# EAGLE schematic PMS_sensor (EAGLE 9.6.2)
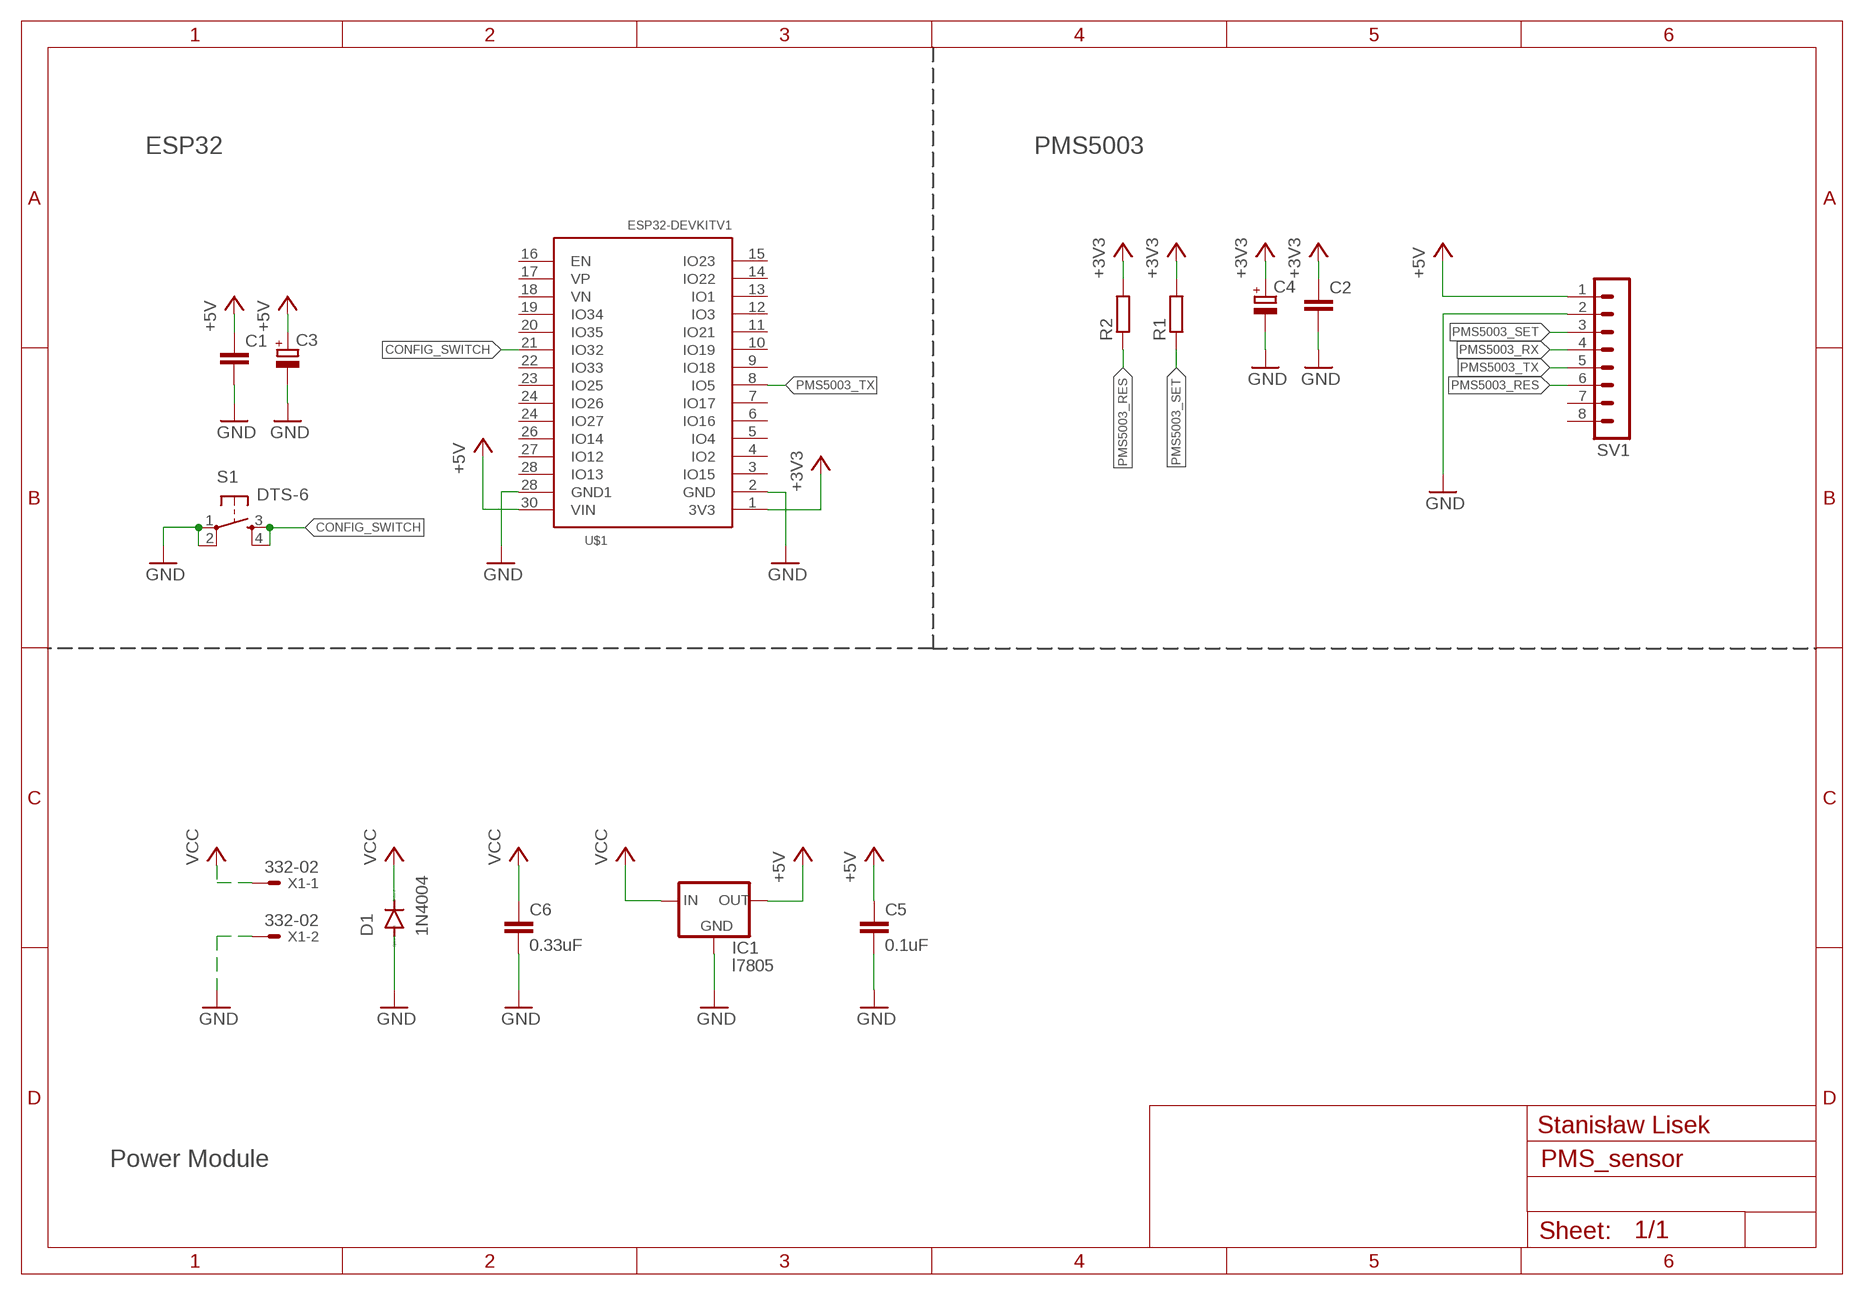
[diagram p0: schematic, sheet 1]

## Parts
C1  C2.5/2  [C2.5-2]
C2  C2.5/2  [C2.5-2]
C3  CPOL-EU153CLV-0810  [153CLV-0810]
C4  CPOL-EU153CLV-0810  [153CLV-0810]
C5  0.1uF  C2.5/2  [C2.5-2]
C6  0.33uF  C2.5/2  [C2.5-2]
D1  1N4004  [DO41-10]
IC1  l7805  78XXS  [78XXS]
R1  R-EU_0207/5V  [0207/5V]
R2  R-EU_0207/5V  [0207/5V]
S1  DTS-6  [DTS-6]
SV1  MA08-1  [MA08-1]
U$1  ESP32DEVKITV1  [ESP32-DEVKITV1]
X1  332-02  [332-02]

## Nets
+3V3: C2.1 C4.+ R1.2
+5V: C1.1 C3.+ C5.1 IC1.OUT SV1.1 U$1.30(VIN)
CONFIG_SWITCH: S1.3 S1.4 U$1.21(IO32)
GND: C1.2 C2.2 C3.- C4.- C5.2 C6.2 D1.A IC1.GND S1.1 S1.2 SV1.2 U$1.2(GND) U$1.28(GND1) X1.2
N$1: U$1.1(3V3) ; supply symbol labelled +3V3
N$5: R2.2 ; supply symbol labelled +3V3
PMS5003_RES: R2.1 SV1.6
PMS5003_RX: SV1.4
PMS5003_SET: R1.1 SV1.3
PMS5003_TX: SV1.5 U$1.8(IO5)
VCC: C6.1 D1.C IC1.IN X1.1
Unconnected: SV1.7 SV1.8 U$1.3(IO15) U$1.4(IO2) U$1.5(IO4) U$1.6(IO16) U$1.7(IO17) U$1.9(IO18) U$1.10(IO19) U$1.11(IO21) U$1.12(IO3) U$1.13(IO1) U$1.14(IO22) U$1.15(IO23) U$1.16(EN) U$1.17(VP) U$1.18(VN) U$1.19(IO34) U$1.20(IO35) U$1.22(IO33) U$1.23(IO25) U$1.24(IO26) U$1.24(IO27) U$1.26(IO14) U$1.27(IO12) U$1.28(IO13)

## Notes on the sheet
- ESP32 | PMS5003
- Stanisław Lisek
- Power Module

## Library data of the parts
C1 C2 C5 C6 = capacitor-wima:C: CAPACITOR naming: grid - package width
C3 C4 = rcl:CPOL-EU: POLARIZED CAPACITOR, European symbol; SPICEPREFIX: C
D1 = diode:1N4004: DIODE general purpose rectifier, 1 A
IC1 = v-reg:78XXS: VOLTAGE REGULATOR
R1 R2 = rcl:R-EU_: RESISTOR, European symbol; SPICEPREFIX: R
S1 = switch-tact:DTS-6
SV1 = con-lstb:MA08-1: PIN HEADER; OC_FARNELL: unknown; OC_NEWARK: unknown
U$1 = ESP32-DEVKITV1:ESP32DEVKITV1
X1 = con-garry:332-02: 2 Pin - 2mm Dual Row Source: www.mpe-connector.de / garry_shortform_2012.pdf